# EAGLE design RGB-light (EAGLE 9.6.1)
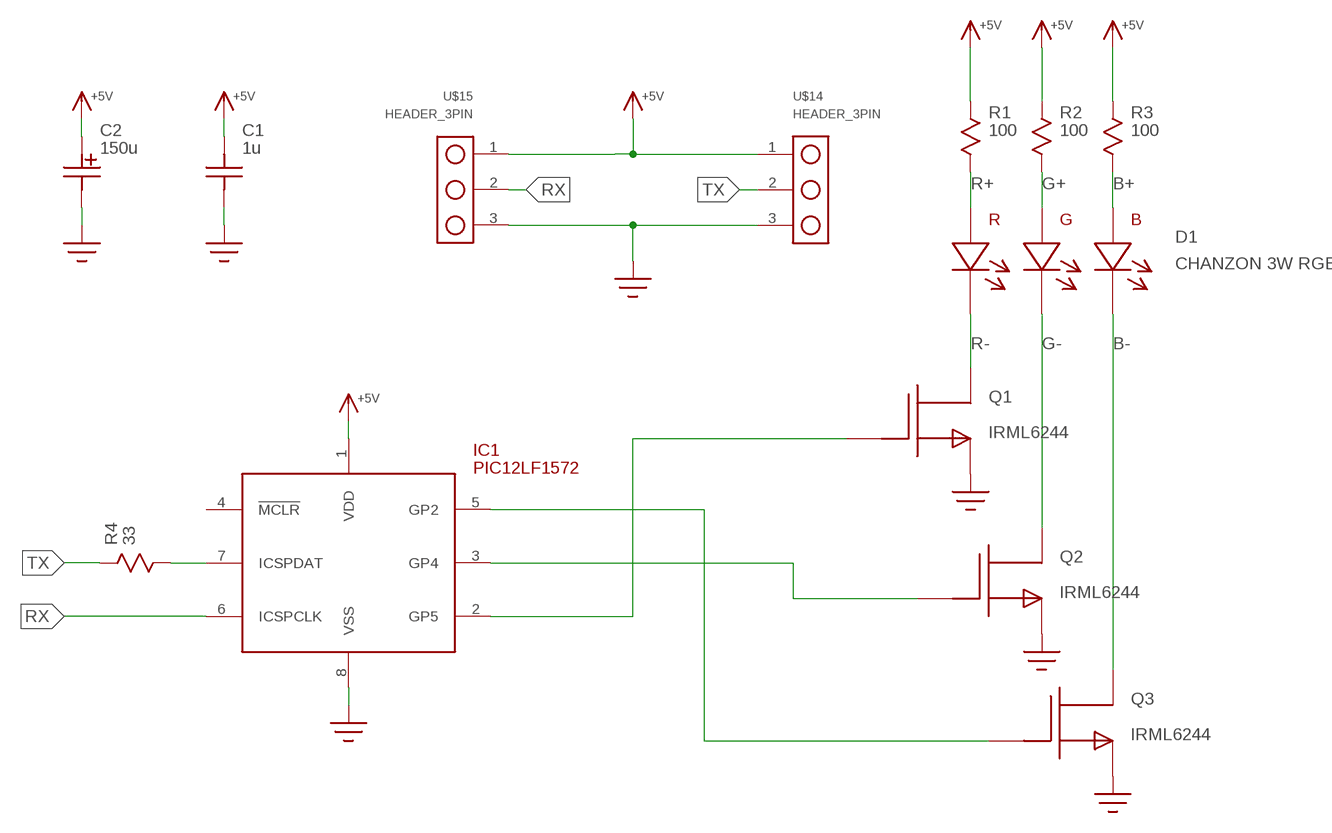
[diagram p0: schematic, sheet 1]

## Parts
C1  1u  C0603  [C0603]
C2  150u  C-POLARIZEDTANTALUM-C  [C-TANTALUM-CODE-C]
D1  CHANZON 3W RGB  LED-RGB-3W  [LED_3W_RGB]
IC1  PIC12LF1572  PIC12LF1571  [SOIC8]
Q1  IRML6244  ZXMN3B01FSOT23  [SOT-23]
Q2  IRML6244  ZXMN3B01FSOT23  [SOT-23]
Q3  IRML6244  ZXMN3B01FSOT23  [SOT-23]
R1  100  R1206  [R1206]
R2  100  R1206  [R1206]
R3  100  R1206  [R1206]
R4  33  R0603  [R0603]
U$14  HEADER_3PIN  [HEADER_3PIN]
U$15  HEADER_3PIN  [HEADER_3PIN]

## Nets
+5V: C1.P$2 C2.+ IC1.1(VDD) R1.P$1 R2.P$1 R3.P$1 U$14.1 U$15.1
B+: D1.B+(B-A) R3.P$2
B-: D1.B-(B-C) Q3.3(D)
G+: D1.G+(G-A) R2.P$2
G-: D1.G-(G-C) Q2.3(D)
GND: C1.P$1 C2.- IC1.8(VSS) Q1.2(S) Q2.2(S) Q3.2(S) U$14.3 U$15.3
N$3: IC1.7(ICSPDAT) R4.P$2
N$7: IC1.5(GP2) Q3.1(G)
N$8: IC1.3(GP4) Q2.1(G)
N$9: IC1.2(GP5) Q1.1(G)
R+: D1.R+(R-A) R1.P$2
R-: D1.R-(R-C) Q1.3(D)
RX: IC1.6(ICSPCLK) U$15.2
TX: R4.P$1 U$14.2
Unconnected: IC1.4(!MCLR!)

## Library data of the parts
C1 = yapo:C
C2 = yapo:C-POLARIZED
D1 = yapo:LED-RGB-3W
IC1 = yapo:PIC12LF1571
Q1-Q3 = yapo:ZXMN3B01F
R1-R4 = yapo:R
U$14 U$15 = yapo:HEADER_3PIN

## Board
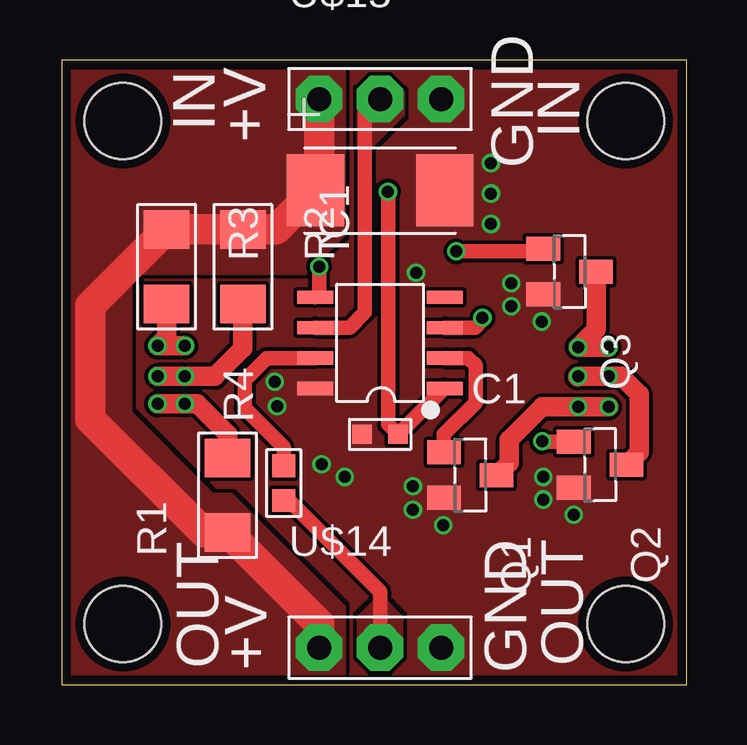
[diagram p1: board, top side]
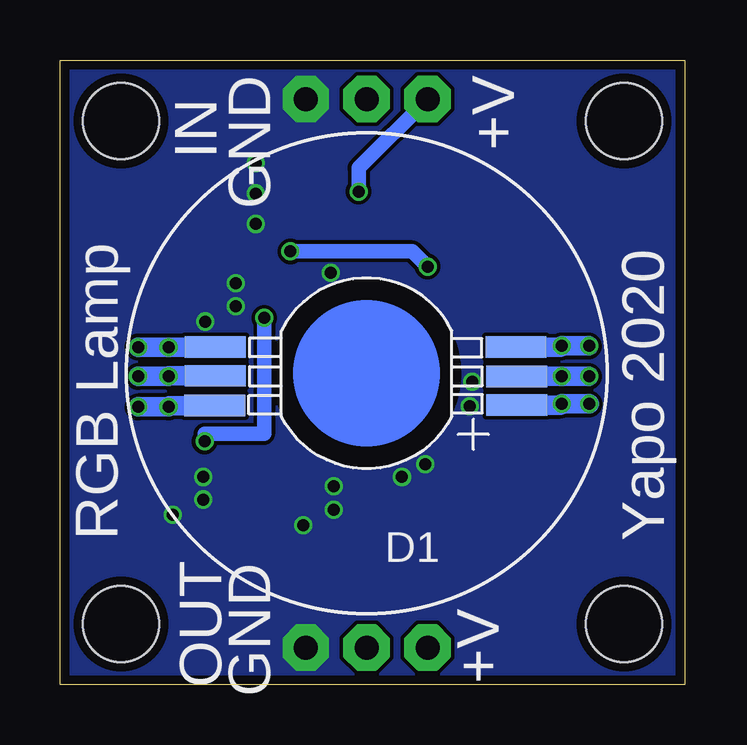
[diagram p2: board, bottom side, seen from below]

Size 26.04 x 26.04 mm. Coordinates in mm from the lower left corner, seen from the top.
Outline: 0,0 26.04,0 26.04,26.04 0,26.04 0,0
Copper layers (1*16): Top 0.035559375mm / dielectric 1.6mm / Bottom 0.035559375mm
Design rules "oshpark-2layer *": minimum track width 6mil, minimum drill 10mil, track to track 6mil, track to pad 6mil, pad to pad 6mil, via to via 6mil, smd to smd 6mil, copper to edge 15mil, drill to drill 6mil, minimum pad ring 5mil, minimum via ring 5mil, stop-mask expansion 2.5mil, vias tented up to drill 25mil, thermal gap 10mil
Holes 3.17 mm at 2.54,2.54 2.54,23.5 23.5,23.5 23.5,2.54

### Footprints (pad centres in the part's own frame; a part is rotated, then mirrored left to right if it is on the bottom)
C0603 = smd 0.8 x 0.8: P$1 -0.75,0; P$2 0.75,0
C-TANTALUM-CODE-C = smd 2.388 x 2.997: + -2.692,0; - 2.692,0
LED_3W_RGB = smd 2.54 x 0.889: B+ -6.223,-1.092; B- 6.299,-1.092; G+ -6.248,0.127; G- 6.299,0.102; R+ -6.248,1.321; R- 6.325,1.346
SOIC8 = smd 0.55 x 1.5: 1 -1.905,-2.7; 2 -0.635,-2.7; 3 0.635,-2.7; 4 1.905,-2.7; 5 1.905,2.7; 6 0.635,2.7; 7 -0.635,2.7; 8 -1.905,2.7
SOT-23 = smd 1 x 1.4: 1 -0.95,-1.1; 2 0.95,-1.1; 3 0,1.1
R1206 = smd 1.6 x 1.9: P$1 -1.55,0; P$2 1.55,0
R0603 = smd 0.95 x 0.95: P$1 -0.725,0; P$2 0.725,0
HEADER_3PIN = drill 1 pad 1.93 octagon: 1 -2.54,0; 2 0,0; 3 2.54,0

### Placement (x,y rotation side)
C1  13.26,10.44 0 top
C2  13.26,20.6 0 top
D1  13.26,12.98 180 bottom
IC1  13.26,14.25 90 top
Q1  17.02,8.74 270 top
Q2  22.43,9.17 270 top
Q3  21.16,17.22 270 top
R1  6.91,7.9 90 top
R2  7.54,17.42 270 top
R3  4.37,17.42 270 top
R4  9.25,8.41 90 top
U$14  13.26,1.55 0 top
U$15  13.26,24.41 0 top

### Tracks (layer width: path | path; a pad name or v marks a point on that pad's centre or on a via)
+5V  (via drill 0.5)
  Top 0.61: IC1.1 15.91,12.34 C1.P$2 13.59,10.86 v13.59,20.55
  Top 1.27: U$15.1 10.72,20.75 C2.+ 8.94,18.97 R2.P$1 R3.P$1 1.19,15.8 1.19,11.07 5.92,6.35 R1.P$1 10.72,2.54 U$14.1
  Bottom 0.61: U$15.1 13.59,21.54 v13.59,20.55
  pour Top (no thermals): 11.76,26.04 11.76,18.75 10.16,17.14 3.17,17.14 2.87,16.84 2.87,11.35 6.27,7.95 7.06,7.95 11.76,3.25 11.76,0 0,0 0,26.04
B+  (via drill 0.5)
  Top 0.813: v5.13,14.12 v3.99,14.12 4.37,14.5 R3.P$2
  Bottom 0.813: D1.B+ 5.18,14.07 v5.13,14.12
B-  (via drill 0.5)
  Top 0.813: 22.76,14.07 v21.51,14.07 22.26,14.82 Q3.3
  Bottom 0.813: D1.B- v21.51,14.07 v22.78,14.07
G+  (via drill 0.5)
  Top 0.813: v3.99,12.85 v5.13,12.85 6.38,12.85 7.54,14.02 R2.P$2
  Bottom 0.813: D1.G+ v5.13,12.85
G-  (via drill 0.5)
  Top 0.813: 21.49,12.83 v21.51,12.85 v22.78,12.85 23.32,12.85 24.05,12.12 24.05,9.7 Q2.3
  Bottom 0.813: D1.G- 21.49,12.88 v21.51,12.85 v22.78,12.85
GND  (via drill 0.5)
  other vias: 10.82,9.19 11.79,8.66 8.86,12.62 8.97,11.61 18.72,16.74 18.72,15.77 14.63,8.28 14.63,7.29 20.07,8.66 20.07,7.72 19.99,15.14 21.34,7.09 15.9,6.65 14.76,17.17 17.88,21.74 17.88,20.47 17.88,19.2
  pour Top (rank 2, no thermals): -1.27,-1.27 -1.27,27.3 27.3,27.3 27.3,-1.27
  pour Bottom (no thermals): -2.54,-1.91 -2.54,28.57 28.57,28.57 28.57,-1.91
N$1
  Bottom 0.813: 5.11,14.12 4.01,14.12
N$2
  Bottom 0.813: 5.13,12.85 4.01,12.85
N$3
  Top 0.61: IC1.7 8.53,13.61 7.62,12.7 7.62,11.52 9.25,9.89 R4.P$2
N$7  (via drill 0.5)
  Top 0.61: IC1.5 10.72,16.31 v10.72,17.42 | v16.43,18.06 19.95,18.06 Q3.1
  Bottom 0.61: v10.72,17.42 11.35,18.06 v16.43,18.06
N$8  (via drill 0.5)
  Top 0.61: IC1.3 17.22,14.88 17.53,15.19 v17.53,15.29 | v20.01,10.15 20.04,10.12 Q2.1
  Bottom 0.61: v17.53,15.29 17.53,10.45 20.01,10.45 v20.01,10.15
N$9
  Top 0.61: IC1.2 16.94,13.61 17.25,13.31 17.25,11.76 15.92,10.43 Q1.1
R+  (via drill 0.5)
  Top 0.813: R1.P$2 6.91,10.44 5.64,11.71 v5.13,11.71 v3.99,11.71
  Bottom 0.813: D1.R+ 5.18,11.66 v5.13,11.71 | 5.11,11.71 v3.99,11.71
R-  (via drill 0.5)
  Top 0.813: Q1.3 18.64,9.26 18.64,10.21 20.02,11.58 v22.78,11.58
  Bottom 0.813: D1.R- 21.46,11.63 v21.51,11.58 v22.78,11.58
RX
  Top 0.61: IC1.6 11.99,14.88 12.62,15.52 12.62,23.77 U$15.2
  pour Top (no thermals): 12.65,22.17 14.22,23.75 14.22,24.69 14.12,24.79 12.34,24.79 12.34,22.48
TX
  Top 0.61: R4.P$1 9.46,7.68 13.26,3.89 U$14.2
  pour Top (no thermals): 14.17,1.27 14.17,2.82 13.26,3.73 12.34,2.82 12.34,1.27

### Text on the board
tPlace: IN | +V | IN | GND | OUT | +V | GND | OUT
bPlace: +V | GND | IN | Yapo 2020 | RGB Lamp | GND | OUT | +V